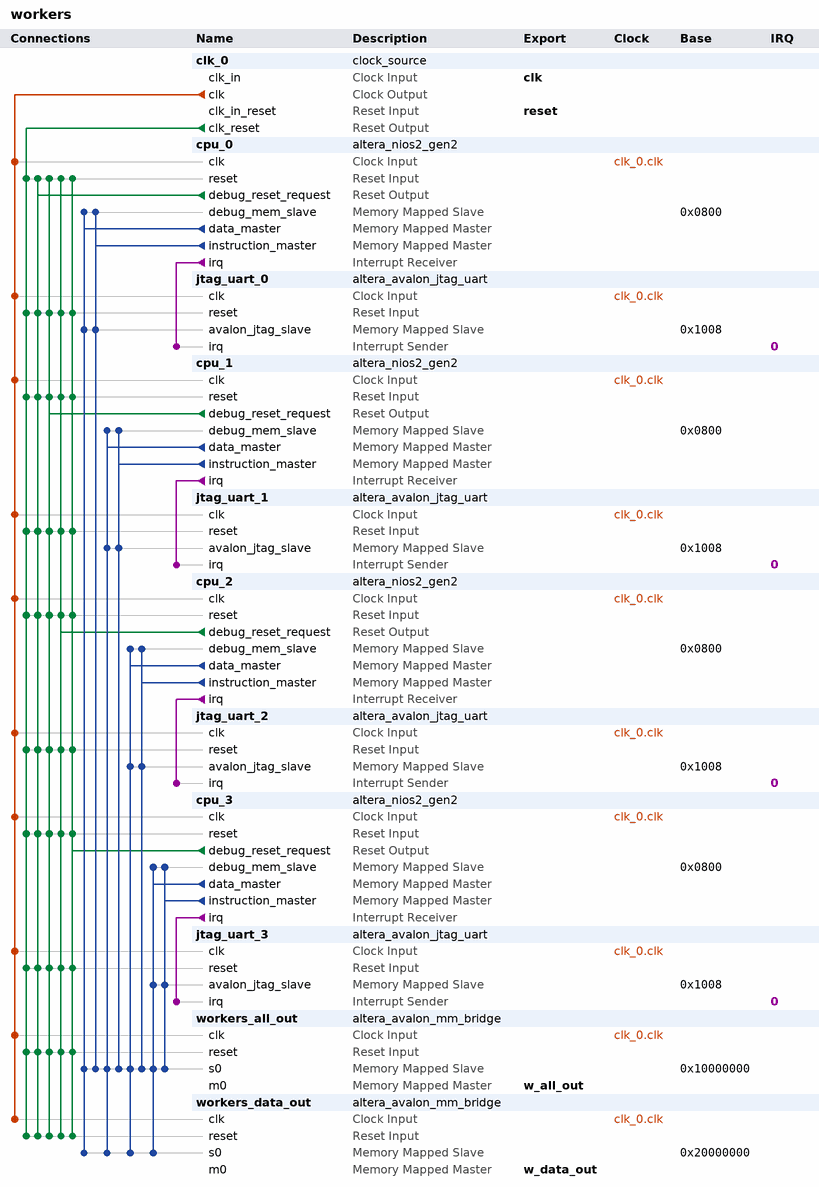
[diagram p0: system contents]
# Platform Designer (Qsys) system workers, Cyclone IV E EP4CE22F17C6
# Parameters at their usual value, and those the tool derives, are not listed.
package require -exact qsys 17.0
create_system workers
set_project_property DEVICE_FAMILY {Cyclone IV E}
set_project_property DEVICE EP4CE22F17C6

add_instance clk_0 clock_source 17.0
set_instance_parameter_value clk_0 clockFrequency 100000000
set_instance_parameter_value clk_0 clockFrequencyKnown false

add_instance cpu_0 altera_nios2_gen2 17.0
set_instance_parameter_value cpu_0 cpuID 1
set_instance_parameter_value cpu_0 dcache_size 2048
set_instance_parameter_value cpu_0 exceptionOffset 335544352
set_instance_parameter_value cpu_0 exceptionSlave Absolute
set_instance_parameter_value cpu_0 icache_size 2048
set_instance_parameter_value cpu_0 impl Fast
set_instance_parameter_value cpu_0 resetOffset 335544320
set_instance_parameter_value cpu_0 resetSlave Absolute

add_instance jtag_uart_0 altera_avalon_jtag_uart 17.0
set_instance_parameter_value jtag_uart_0 simInteractiveOptions NO_INTERACTIVE_WINDOWS

add_instance cpu_1 altera_nios2_gen2 17.0
set_instance_parameter_value cpu_1 cpuID 2
set_instance_parameter_value cpu_1 dcache_size 2048
set_instance_parameter_value cpu_1 exceptionOffset 340262944
set_instance_parameter_value cpu_1 exceptionSlave Absolute
set_instance_parameter_value cpu_1 icache_size 2048
set_instance_parameter_value cpu_1 impl Fast
set_instance_parameter_value cpu_1 resetOffset 340262912
set_instance_parameter_value cpu_1 resetSlave Absolute

add_instance jtag_uart_1 altera_avalon_jtag_uart 17.0
set_instance_parameter_value jtag_uart_1 simInteractiveOptions NO_INTERACTIVE_WINDOWS

add_instance cpu_2 altera_nios2_gen2 17.0
set_instance_parameter_value cpu_2 cpuID 3
set_instance_parameter_value cpu_2 dcache_size 2048
set_instance_parameter_value cpu_2 exceptionOffset 344981536
set_instance_parameter_value cpu_2 exceptionSlave Absolute
set_instance_parameter_value cpu_2 icache_size 2048
set_instance_parameter_value cpu_2 impl Fast
set_instance_parameter_value cpu_2 resetOffset 344981504
set_instance_parameter_value cpu_2 resetSlave Absolute

add_instance jtag_uart_2 altera_avalon_jtag_uart 17.0
set_instance_parameter_value jtag_uart_2 simInteractiveOptions NO_INTERACTIVE_WINDOWS

add_instance cpu_3 altera_nios2_gen2 17.0
set_instance_parameter_value cpu_3 cpuID 4
set_instance_parameter_value cpu_3 dcache_size 2048
set_instance_parameter_value cpu_3 exceptionOffset 349700128
set_instance_parameter_value cpu_3 exceptionSlave Absolute
set_instance_parameter_value cpu_3 icache_size 2048
set_instance_parameter_value cpu_3 impl Fast
set_instance_parameter_value cpu_3 resetOffset 349700096
set_instance_parameter_value cpu_3 resetSlave Absolute

add_instance jtag_uart_3 altera_avalon_jtag_uart 17.0
set_instance_parameter_value jtag_uart_3 simInteractiveOptions NO_INTERACTIVE_WINDOWS

add_instance workers_all_out altera_avalon_mm_bridge 17.0
set_instance_parameter_value workers_all_out ADDRESS_UNITS SYMBOLS
set_instance_parameter_value workers_all_out ADDRESS_WIDTH 28
set_instance_parameter_value workers_all_out DATA_WIDTH 32
set_instance_parameter_value workers_all_out MAX_PENDING_RESPONSES 4
set_instance_parameter_value workers_all_out USE_AUTO_ADDRESS_WIDTH 0

add_instance workers_data_out altera_avalon_mm_bridge 17.0
set_instance_parameter_value workers_data_out ADDRESS_UNITS SYMBOLS
set_instance_parameter_value workers_data_out ADDRESS_WIDTH 28
set_instance_parameter_value workers_data_out DATA_WIDTH 32
set_instance_parameter_value workers_data_out MAX_PENDING_RESPONSES 4
set_instance_parameter_value workers_data_out USE_AUTO_ADDRESS_WIDTH 0

# connections
add_connection clk_0.clk cpu_0.clk clock
add_connection clk_0.clk cpu_1.clk clock
add_connection clk_0.clk cpu_2.clk clock
add_connection clk_0.clk cpu_3.clk clock
add_connection clk_0.clk jtag_uart_0.clk clock
add_connection clk_0.clk jtag_uart_1.clk clock
add_connection clk_0.clk jtag_uart_2.clk clock
add_connection clk_0.clk jtag_uart_3.clk clock
add_connection clk_0.clk workers_all_out.clk clock
add_connection clk_0.clk workers_data_out.clk clock
add_connection clk_0.clk_reset cpu_0.reset reset
add_connection clk_0.clk_reset cpu_1.reset reset
add_connection clk_0.clk_reset cpu_2.reset reset
add_connection clk_0.clk_reset cpu_3.reset reset
add_connection clk_0.clk_reset jtag_uart_0.reset reset
add_connection clk_0.clk_reset jtag_uart_1.reset reset
add_connection clk_0.clk_reset jtag_uart_2.reset reset
add_connection clk_0.clk_reset jtag_uart_3.reset reset
add_connection clk_0.clk_reset workers_all_out.reset reset
add_connection clk_0.clk_reset workers_data_out.reset reset
add_connection cpu_0.debug_reset_request cpu_0.reset reset
add_connection cpu_0.debug_reset_request cpu_1.reset reset
add_connection cpu_0.debug_reset_request cpu_2.reset reset
add_connection cpu_0.debug_reset_request cpu_3.reset reset
add_connection cpu_0.debug_reset_request jtag_uart_0.reset reset
add_connection cpu_0.debug_reset_request jtag_uart_1.reset reset
add_connection cpu_0.debug_reset_request jtag_uart_2.reset reset
add_connection cpu_0.debug_reset_request jtag_uart_3.reset reset
add_connection cpu_0.debug_reset_request workers_all_out.reset reset
add_connection cpu_0.debug_reset_request workers_data_out.reset reset
add_connection cpu_1.debug_reset_request cpu_0.reset reset
add_connection cpu_1.debug_reset_request cpu_1.reset reset
add_connection cpu_1.debug_reset_request cpu_2.reset reset
add_connection cpu_1.debug_reset_request cpu_3.reset reset
add_connection cpu_1.debug_reset_request jtag_uart_0.reset reset
add_connection cpu_1.debug_reset_request jtag_uart_1.reset reset
add_connection cpu_1.debug_reset_request jtag_uart_2.reset reset
add_connection cpu_1.debug_reset_request jtag_uart_3.reset reset
add_connection cpu_1.debug_reset_request workers_all_out.reset reset
add_connection cpu_1.debug_reset_request workers_data_out.reset reset
add_connection cpu_2.debug_reset_request cpu_0.reset reset
add_connection cpu_2.debug_reset_request cpu_1.reset reset
add_connection cpu_2.debug_reset_request cpu_2.reset reset
add_connection cpu_2.debug_reset_request cpu_3.reset reset
add_connection cpu_2.debug_reset_request jtag_uart_0.reset reset
add_connection cpu_2.debug_reset_request jtag_uart_1.reset reset
add_connection cpu_2.debug_reset_request jtag_uart_2.reset reset
add_connection cpu_2.debug_reset_request jtag_uart_3.reset reset
add_connection cpu_2.debug_reset_request workers_all_out.reset reset
add_connection cpu_2.debug_reset_request workers_data_out.reset reset
add_connection cpu_3.debug_reset_request cpu_0.reset reset
add_connection cpu_3.debug_reset_request cpu_1.reset reset
add_connection cpu_3.debug_reset_request cpu_2.reset reset
add_connection cpu_3.debug_reset_request cpu_3.reset reset
add_connection cpu_3.debug_reset_request jtag_uart_0.reset reset
add_connection cpu_3.debug_reset_request jtag_uart_1.reset reset
add_connection cpu_3.debug_reset_request jtag_uart_2.reset reset
add_connection cpu_3.debug_reset_request jtag_uart_3.reset reset
add_connection cpu_3.debug_reset_request workers_all_out.reset reset
add_connection cpu_3.debug_reset_request workers_data_out.reset reset
add_connection cpu_0.data_master cpu_0.debug_mem_slave avalon
set_connection_parameter_value cpu_0.data_master/cpu_0.debug_mem_slave baseAddress 0x0800
add_connection cpu_0.data_master jtag_uart_0.avalon_jtag_slave avalon
set_connection_parameter_value cpu_0.data_master/jtag_uart_0.avalon_jtag_slave baseAddress 0x1008
add_connection cpu_0.data_master workers_all_out.s0 avalon
set_connection_parameter_value cpu_0.data_master/workers_all_out.s0 baseAddress 0x10000000
add_connection cpu_0.data_master workers_data_out.s0 avalon
set_connection_parameter_value cpu_0.data_master/workers_data_out.s0 baseAddress 0x20000000
add_connection cpu_0.instruction_master cpu_0.debug_mem_slave avalon
set_connection_parameter_value cpu_0.instruction_master/cpu_0.debug_mem_slave baseAddress 0x0800
add_connection cpu_0.instruction_master jtag_uart_0.avalon_jtag_slave avalon
set_connection_parameter_value cpu_0.instruction_master/jtag_uart_0.avalon_jtag_slave baseAddress 0x1008
add_connection cpu_0.instruction_master workers_all_out.s0 avalon
set_connection_parameter_value cpu_0.instruction_master/workers_all_out.s0 baseAddress 0x10000000
add_connection cpu_1.data_master cpu_1.debug_mem_slave avalon
set_connection_parameter_value cpu_1.data_master/cpu_1.debug_mem_slave baseAddress 0x0800
add_connection cpu_1.data_master jtag_uart_1.avalon_jtag_slave avalon
set_connection_parameter_value cpu_1.data_master/jtag_uart_1.avalon_jtag_slave baseAddress 0x1008
add_connection cpu_1.data_master workers_all_out.s0 avalon
set_connection_parameter_value cpu_1.data_master/workers_all_out.s0 baseAddress 0x10000000
add_connection cpu_1.data_master workers_data_out.s0 avalon
set_connection_parameter_value cpu_1.data_master/workers_data_out.s0 baseAddress 0x20000000
add_connection cpu_1.instruction_master cpu_1.debug_mem_slave avalon
set_connection_parameter_value cpu_1.instruction_master/cpu_1.debug_mem_slave baseAddress 0x0800
add_connection cpu_1.instruction_master jtag_uart_1.avalon_jtag_slave avalon
set_connection_parameter_value cpu_1.instruction_master/jtag_uart_1.avalon_jtag_slave baseAddress 0x1008
add_connection cpu_1.instruction_master workers_all_out.s0 avalon
set_connection_parameter_value cpu_1.instruction_master/workers_all_out.s0 baseAddress 0x10000000
add_connection cpu_2.data_master cpu_2.debug_mem_slave avalon
set_connection_parameter_value cpu_2.data_master/cpu_2.debug_mem_slave baseAddress 0x0800
add_connection cpu_2.data_master jtag_uart_2.avalon_jtag_slave avalon
set_connection_parameter_value cpu_2.data_master/jtag_uart_2.avalon_jtag_slave baseAddress 0x1008
add_connection cpu_2.data_master workers_all_out.s0 avalon
set_connection_parameter_value cpu_2.data_master/workers_all_out.s0 baseAddress 0x10000000
add_connection cpu_2.data_master workers_data_out.s0 avalon
set_connection_parameter_value cpu_2.data_master/workers_data_out.s0 baseAddress 0x20000000
add_connection cpu_2.instruction_master cpu_2.debug_mem_slave avalon
set_connection_parameter_value cpu_2.instruction_master/cpu_2.debug_mem_slave baseAddress 0x0800
add_connection cpu_2.instruction_master jtag_uart_2.avalon_jtag_slave avalon
set_connection_parameter_value cpu_2.instruction_master/jtag_uart_2.avalon_jtag_slave baseAddress 0x1008
add_connection cpu_2.instruction_master workers_all_out.s0 avalon
set_connection_parameter_value cpu_2.instruction_master/workers_all_out.s0 baseAddress 0x10000000
add_connection cpu_3.data_master cpu_3.debug_mem_slave avalon
set_connection_parameter_value cpu_3.data_master/cpu_3.debug_mem_slave baseAddress 0x0800
add_connection cpu_3.data_master jtag_uart_3.avalon_jtag_slave avalon
set_connection_parameter_value cpu_3.data_master/jtag_uart_3.avalon_jtag_slave baseAddress 0x1008
add_connection cpu_3.data_master workers_all_out.s0 avalon
set_connection_parameter_value cpu_3.data_master/workers_all_out.s0 baseAddress 0x10000000
add_connection cpu_3.data_master workers_data_out.s0 avalon
set_connection_parameter_value cpu_3.data_master/workers_data_out.s0 baseAddress 0x20000000
add_connection cpu_3.instruction_master cpu_3.debug_mem_slave avalon
set_connection_parameter_value cpu_3.instruction_master/cpu_3.debug_mem_slave baseAddress 0x0800
add_connection cpu_3.instruction_master jtag_uart_3.avalon_jtag_slave avalon
set_connection_parameter_value cpu_3.instruction_master/jtag_uart_3.avalon_jtag_slave baseAddress 0x1008
add_connection cpu_3.instruction_master workers_all_out.s0 avalon
set_connection_parameter_value cpu_3.instruction_master/workers_all_out.s0 baseAddress 0x10000000
add_connection cpu_0.irq jtag_uart_0.irq interrupt
set_connection_parameter_value cpu_0.irq/jtag_uart_0.irq irqNumber 0
add_connection cpu_1.irq jtag_uart_1.irq interrupt
set_connection_parameter_value cpu_1.irq/jtag_uart_1.irq irqNumber 0
add_connection cpu_2.irq jtag_uart_2.irq interrupt
set_connection_parameter_value cpu_2.irq/jtag_uart_2.irq irqNumber 0
add_connection cpu_3.irq jtag_uart_3.irq interrupt
set_connection_parameter_value cpu_3.irq/jtag_uart_3.irq irqNumber 0

# exported interfaces
add_interface clk clock sink
set_interface_property clk EXPORT_OF clk_0.clk_in
add_interface reset reset sink
set_interface_property reset EXPORT_OF clk_0.clk_in_reset
add_interface w_all_out avalon master
set_interface_property w_all_out EXPORT_OF workers_all_out.m0
add_interface w_data_out avalon master
set_interface_property w_data_out EXPORT_OF workers_data_out.m0

set_interconnect_requirement {$system} qsys_mm.clockCrossingAdapter HANDSHAKE
set_interconnect_requirement {$system} qsys_mm.enableEccProtection FALSE
set_interconnect_requirement {$system} qsys_mm.insertDefaultSlave FALSE
set_interconnect_requirement {$system} qsys_mm.maxAdditionalLatency 1

save_system workers.qsys
